# Altium project JacdacBreadboardRingsWasherG 109.PrjPCB
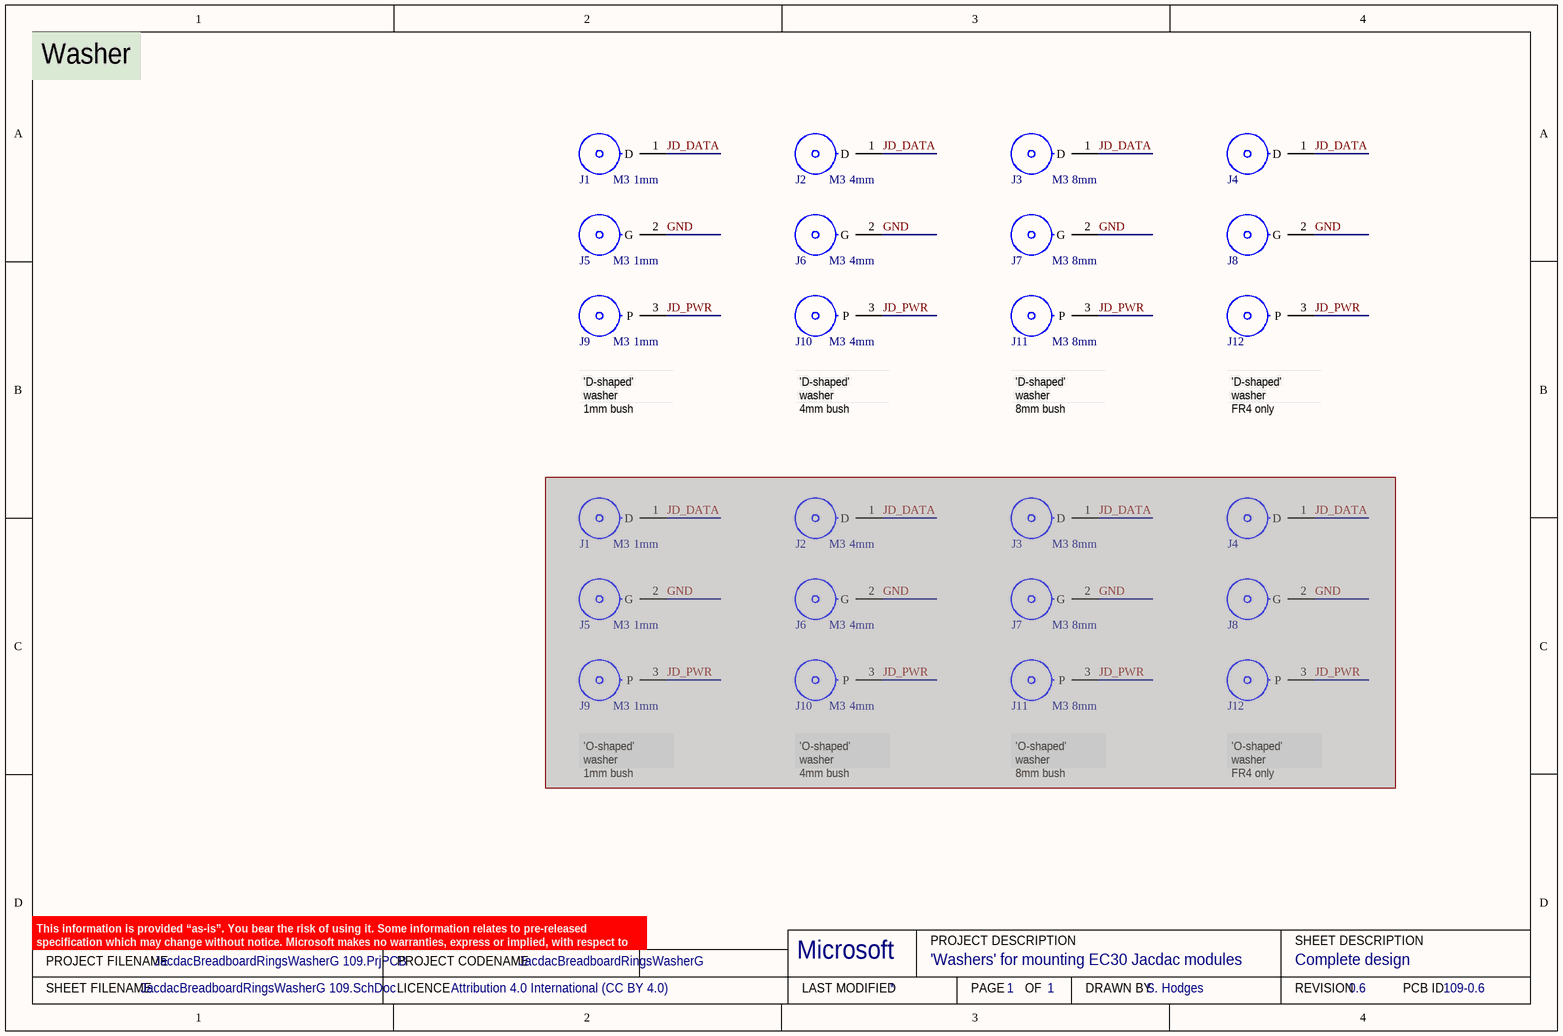
[diagram p0: JacdacBreadboardRingsWasherG 109.SchDoc]
ProjectRevision: 0.6; ProjectLicenceTerms: Attribution 4.0 International (CC BY 4.0); ProjectDrawnBy: S. Hodges; ProjectCodenameID: 109; ProjectCodenameDescription: 'Washers' for mounting EC30 Jacdac modules; ProjectCodeName: JacdacBreadboardRingsWasherG
1 sheet, 24 parts. Net scope: global (net labels, ports and power ports of the same name join across sheets).
Board files: JacdacBreadboardRingsWasherG 109 oblong.PcbDoc, JacdacBreadboardRingsWasherG 109.PcbDoc, JacdacBreadboardRingsWasherG 109Q.PcbDoc, JacdacBreadboardRingsWasherG 109 oblong.PcbDoc, JacdacBreadboardRingsWasherG 109 oblong-single.PcbDoc, JacdacBreadboardRingsWasherG 109 oblong-panel.PcbDoc, JacdacBreadboardRingsWasherG 109 D-shaped.PcbDoc, JacdacBreadboardRingsWasherG 109 D-shaped-panel.PcbDoc

## Sheet JacdacBreadboardRingsWasherG 109.SchDoc: Complete design
size A4; DrawnBy: S. Hodges; DocumentNumber: 1; Revision: 0.6; SheetNumber: 1; SheetTotal: 1; VersionControl_RevNumber: 1

### Parts
(Parts that share a designator on the sheet are numbered #1, #2 ... from top to bottom, then left to right.)
J1#1  Diameter: M3  Standoff Height: 1mm  [jacdac ec30-8 1mm-bush-washer-d pin1]  (hidden comment: Jacdac EC30 1mm-bush-washer JD_DATA)
J1#2  Diameter: M3  Standoff Height: 1mm  [jacdac ec30-8 1mm-bush-washer-o pin1]  (hidden comment: Jacdac EC30 1mm-bush-washer JD_DATA)  (masked out: inside a compile mask, not in the netlist)
J2#1  Standoff Height: 4mm  Diameter: M3  [jacdac ec30-8 4mm-bush-washer-d pin1]  (hidden comment: Jacdac EC30 4mm-bush-washer JD_DATA)
J2#2  Standoff Height: 4mm  Diameter: M3  [jacdac ec30-8 4mm-bush-washer-o pin1]  (hidden comment: Jacdac EC30 4mm-bush-washer JD_DATA)  (masked out: inside a compile mask, not in the netlist)
J3#1  Standoff Height: 8mm  Diameter: M3  [jacdac ec30-8 8mm-bush-washer-d pin1]  (hidden comment: Jacdac EC30 8mm-bush-washer JD_DATA)
J3#2  Standoff Height: 8mm  Diameter: M3  [jacdac ec30-8 8mm-bush-washer-o pin1]  (hidden comment: Jacdac EC30 8mm-bush-washer JD_DATA)  (masked out: inside a compile mask, not in the netlist)
J4#1  Jacdac EC30 fr4-washer JD_DATA  [jacdac ec30-8 fr4-washer-d pin1]  (value not drawn)  (no BOM)
J4#2  Jacdac EC30 fr4-washer JD_DATA  [jacdac ec30-8 fr4-washer-d pin1]  (value not drawn)  (no BOM)  (masked out: inside a compile mask, not in the netlist)
J5#1  Diameter: M3  Standoff Height: 1mm  [jacdac ec30-8 1mm-bush-washer-d pin2 jlc]  (hidden comment: Jacdac EC30 1mm-bush-washer GND)
J5#2  Diameter: M3  Standoff Height: 1mm  [jacdac ec30-8 1mm-bush-washer-o pin2 jlc]  (hidden comment: Jacdac EC30 1mm-bush-washer GND)  (masked out: inside a compile mask, not in the netlist)
J6#1  Standoff Height: 4mm  Diameter: M3  [jacdac ec30-8 4mm-bush-washer-d pin2 jlc]  (hidden comment: Jacdac EC30 4mm-bush-washer GND)
J6#2  Standoff Height: 4mm  Diameter: M3  [jacdac ec30-8 4mm-bush-washer-o pin2 jlc]  (hidden comment: Jacdac EC30 4mm-bush-washer GND)  (masked out: inside a compile mask, not in the netlist)
J7#1  Standoff Height: 8mm  Diameter: M3  [jacdac ec30-8 8mm-bush-washer-d pin2 jlc]  (hidden comment: Jacdac EC30 8mm-bush-washer GND)
J7#2  Standoff Height: 8mm  Diameter: M3  [jacdac ec30-8 8mm-bush-washer-o pin2 jlc]  (hidden comment: Jacdac EC30 8mm-bush-washer GND)  (masked out: inside a compile mask, not in the netlist)
J8#1  Jacdac EC30 fr4-washer GND  [jacdac ec30-8 fr4-washer-d pin2 jlc]  (value not drawn)  (no BOM)
J8#2  Jacdac EC30 fr4-washer GND  [jacdac ec30-8 fr4-washer-d pin2 jlc]  (value not drawn)  (no BOM)  (masked out: inside a compile mask, not in the netlist)
J9#1  Diameter: M3  Standoff Height: 1mm  [jacdac ec30-8 1mm-bush-washer-d pin3 jlc]  (hidden comment: Jacdac EC30 1mm-bush-washer JD_PWR)
J9#2  Diameter: M3  Standoff Height: 1mm  [jacdac ec30-8 1mm-bush-washer-o pin3 jlc]  (hidden comment: Jacdac EC30 1mm-bush-washer JD_PWR)  (masked out: inside a compile mask, not in the netlist)
J10#1  Standoff Height: 4mm  Diameter: M3  [jacdac ec30-8 4mm-bush-washer-d pin3 jlc]  (hidden comment: Jacdac EC30 4mm-bush-washer JD_PWR)
J10#2  Standoff Height: 4mm  Diameter: M3  [jacdac ec30-8 4mm-bush-washer-o pin3 jlc]  (hidden comment: Jacdac EC30 4mm-bush-washer JD_PWR)  (masked out: inside a compile mask, not in the netlist)
J11#1  Standoff Height: 8mm  Diameter: M3  [jacdac ec30-8 8mm-bush-washer-d pin3 jlc]  (hidden comment: Jacdac EC30 8mm-bush-washer JD_PWR)
J11#2  Standoff Height: 8mm  Diameter: M3  [jacdac ec30-8 8mm-bush-washer-o pin3 jlc]  (hidden comment: Jacdac EC30 8mm-bush-washer JD_PWR)  (masked out: inside a compile mask, not in the netlist)
J12#1  Jacdac EC30 fr4-washer JD_PWR  [jacdac ec30-8 fr4-washer-d pin3 jlc]  (value not drawn)  (no BOM)
J12#2  Jacdac EC30 fr4-washer JD_PWR  [jacdac ec30-8 fr4-washer-d pin3 jlc]  (value not drawn)  (no BOM)  (masked out: inside a compile mask, not in the netlist)

### Nets
GND: J5#1.2(G) J6#1.2(G) J7#1.2(G) J8#1.2(G)
JD_DATA: J1#1.1(D) J2#1.1(D) J3#1.1(D) J4#1.1(D)
JD_PWR: J9#1.3(P) J10#1.3(P) J11#1.3(P) J12#1.3(P)

### Notes on the sheet
- Washer
- 'D-shaped' washer
  1mm bush
- 'D-shaped' washer
  4mm bush
- 'D-shaped' washer
  8mm bush
- 'D-shaped' washer
  FR4 only
- 'O-shaped' washer
  1mm bush
- 'O-shaped' washer
  4mm bush
- 'O-shaped' washer
  8mm bush
- 'O-shaped' washer
  FR4 only
- This information is provided “as-is”. You bear the risk of using it. Some information relates to pre-released specification which may change without notice. Microsoft makes no warranties, express or implied, with respect to the information provided here.
- PROJECT FILENAME
- PROJECT CODENAME
- Microsoft
- PROJECT DESCRIPTION
- SHEET DESCRIPTION
- SHEET FILENAME
- LICENCE
- LAST MODIFIED
- PAGE
- OF
- DRAWN BY
- REVISION
- PCB ID

### Library data of the parts
J4#1 J4#2 = Jacdac EC30 fr4-washer JD_DATA: Hole Size: M3
J8#1 J8#2 = Jacdac EC30 fr4-washer GND: Hole Size: M3
J12#1 J12#2 = Jacdac EC30 fr4-washer JD_PWR: Hole Size: M3
J1#1 J1#2 = Jacdac EC30 1mm-bush-washer JD_DATA: Supplier 1: LCSC; Supplier Part Number 1: C2916331
J2#1 J2#2 = Jacdac EC30 4mm-bush-washer JD_DATA: Supplier 1: LCSC; Supplier Part Number 1: C2915635; Supplier 2: LCSC; Supplier Part Number 2: C2916382
J3#1 J3#2 = Jacdac EC30 8mm-bush-washer JD_DATA: Supplier 1: LCSC; Supplier Part Number 1: C2916369; Supplier 2: LCSC; Supplier Part Number 2: C2916368
J5#1 J5#2 = Jacdac EC30 1mm-bush-washer GND: Supplier 1: LCSC; Supplier Part Number 1: C2916331
J6#1 J6#2 = Jacdac EC30 4mm-bush-washer GND: Supplier 1: LCSC; Supplier Part Number 1: C2915635; Supplier 2: LCSC; Supplier Part Number 2: C2916382
J7#1 J7#2 = Jacdac EC30 8mm-bush-washer GND: Supplier 1: LCSC; Supplier Part Number 1: C2916369; Supplier 2: LCSC; Supplier Part Number 2: C2916368
J9#1 J9#2 = Jacdac EC30 1mm-bush-washer JD_PWR: Supplier 1: LCSC; Supplier Part Number 1: C2916331
J10#1 J10#2 = Jacdac EC30 4mm-bush-washer JD_PWR: Supplier 1: LCSC; Supplier Part Number 1: C2915635; Supplier 2: LCSC; Supplier Part Number 2: C2916382
J11#1 J11#2 = Jacdac EC30 8mm-bush-washer JD_PWR: Supplier 1: LCSC; Supplier Part Number 1: C2916369; Supplier 2: LCSC; Supplier Part Number 2: C2916368